# Altium project EthernetSwitchBoard.PrjPcb
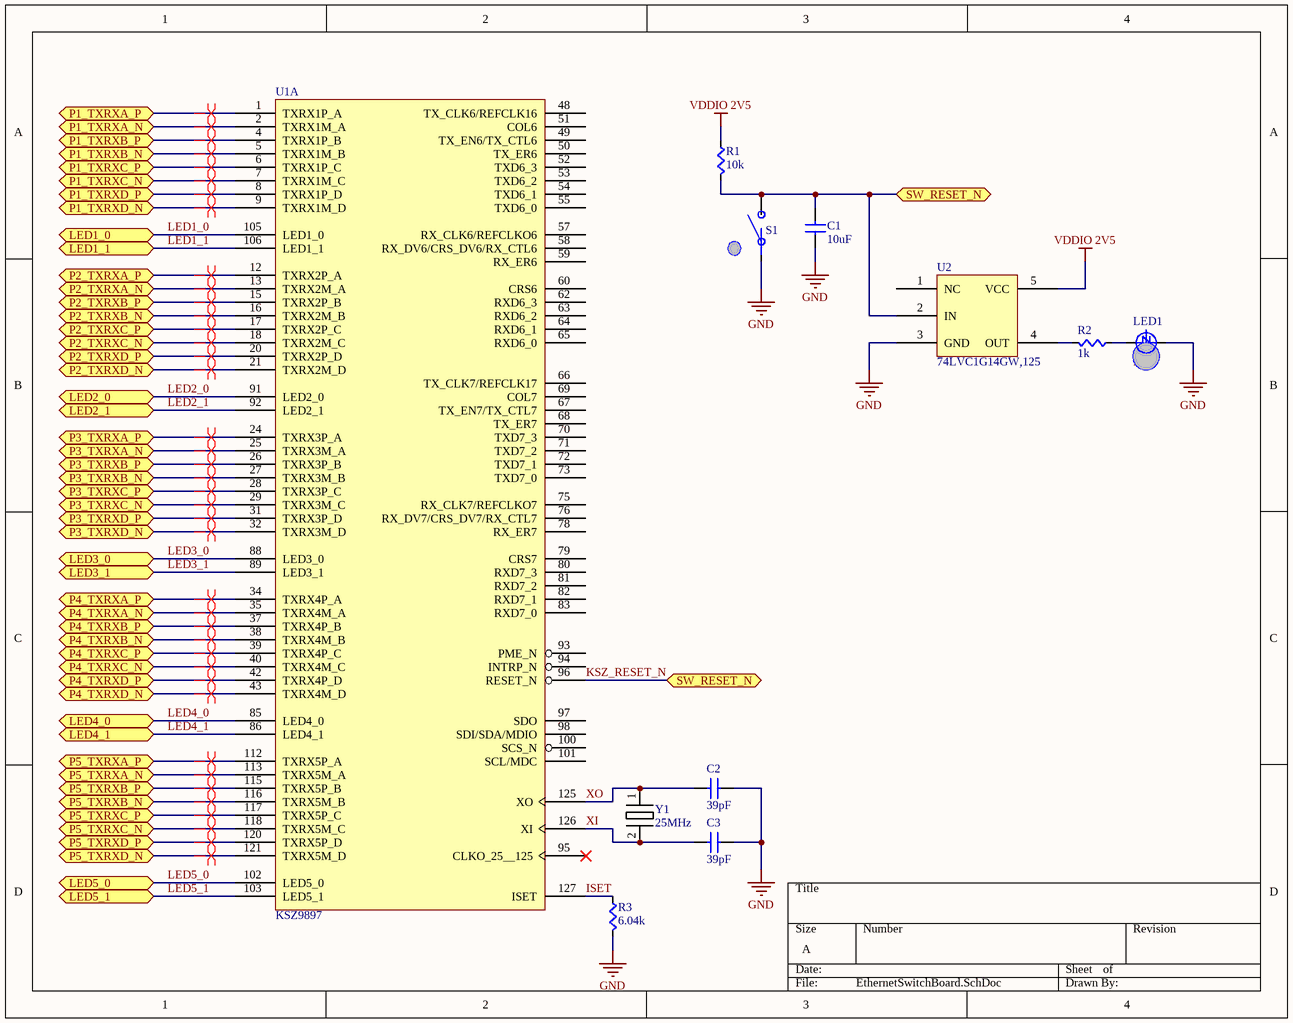
[diagram p0: EthernetSwitchBoard.SchDoc]
3 sheets, 145 parts. Net scope: flat (ports and power ports of the same name join across sheets).
Board file: EthernetSwitchBoard.PcbDoc
Sheets:
  EthernetSwitchBoard.SchDoc
  SwitchPower.SchDoc
  SwitchConnectors.SchDoc

## Sheet EthernetSwitchBoard.SchDoc
size A

### Parts
C1  value 10uF  [CAPC0603]  (hidden comment: Cap)
C2  value 39pF  [CAPC0603]  (hidden comment: Cap)
C3  value 39pF  [CAPC0603]  (hidden comment: Cap)
LED1  Color: Red  [LED0603]  (hidden comment: LED)
R1  value 10k  [RES0603]  (hidden comment: Res)
R2  value 1k  [RES0603]  (hidden comment: Res)
R3  value 6.04k  [RES0603]  (hidden comment: Res)
S1  Button  [PTS645xxxxSMTR92]  (value not drawn)
U1  KSZ9897  [128-TQFP]  (part A of 2)
U2  74LVC1G14GW,125  [SOT35-5pin]
Y1  25MHz  [HC49/US]

### Ports
LED1_0 (bidir), LED1_1 (bidir), LED2_0 (bidir), LED2_1 (bidir), LED3_0 (bidir), LED3_1 (bidir), LED4_0 (bidir), LED4_1 (bidir), LED5_0 (bidir), LED5_1 (bidir), P1_TXRXA_N (bidir), P1_TXRXA_P (bidir), P1_TXRXB_N (bidir), P1_TXRXB_P (bidir), P1_TXRXC_N (bidir), P1_TXRXC_P (bidir), P1_TXRXD_N (bidir), P1_TXRXD_P (bidir), P2_TXRXA_N (bidir), P2_TXRXA_P (bidir), P2_TXRXB_N (bidir), P2_TXRXB_P (bidir), P2_TXRXC_N (bidir), P2_TXRXC_P (bidir), P2_TXRXD_N (bidir), P2_TXRXD_P (bidir), P3_TXRXA_N (bidir), P3_TXRXA_P (bidir), P3_TXRXB_N (bidir), P3_TXRXB_P (bidir), P3_TXRXC_N (bidir), P3_TXRXC_P (bidir), P3_TXRXD_N (bidir), P3_TXRXD_P (bidir), P4_TXRXA_N (bidir), P4_TXRXA_P (bidir), P4_TXRXB_N (bidir), P4_TXRXB_P (bidir), P4_TXRXC_N (bidir), P4_TXRXC_P (bidir), P4_TXRXD_N (bidir), P4_TXRXD_P (bidir), P5_TXRXA_N (bidir), P5_TXRXA_P (bidir), P5_TXRXB_N (bidir), P5_TXRXB_P (bidir), P5_TXRXC_N (bidir), P5_TXRXC_P (bidir), P5_TXRXD_N (bidir), P5_TXRXD_P (bidir), SW_RESET_N (bidir)

### Nets
GND: C1.2(B) C2.2(B) C3.2(B) LED1.C R3.1(A) S1.A U2.3(GND)
VDDIO 2V5: R1.2(B) U2.5(VCC)
ISET: R3.2(B) U1.127(ISET)
KSZ_RESET_N: C1.1(A) R1.1(A) S1.B U1.96(RESET_N) U2.2(IN) ; port SW_RESET_N
LED1_0: U1.105(LED1_0) ; port LED1_0
LED1_1: U1.106(LED1_1) ; port LED1_1
LED2_0: U1.91(LED2_0) ; port LED2_0
LED2_1: U1.92(LED2_1) ; port LED2_1
LED3_0: U1.88(LED3_0) ; port LED3_0
LED3_1: U1.89(LED3_1) ; port LED3_1
LED4_0: U1.85(LED4_0) ; port LED4_0
LED4_1: U1.86(LED4_1) ; port LED4_1
LED5_0: U1.102(LED5_0) ; port LED5_0
LED5_1: U1.103(LED5_1) ; port LED5_1
P1_TXRXA_N: U1.2(TXRX1M_A) ; port P1_TXRXA_N
P1_TXRXA_P: U1.1(TXRX1P_A) ; port P1_TXRXA_P
P1_TXRXB_N: U1.5(TXRX1M_B) ; port P1_TXRXB_N
P1_TXRXB_P: U1.4(TXRX1P_B) ; port P1_TXRXB_P
P1_TXRXC_N: U1.7(TXRX1M_C) ; port P1_TXRXC_N
P1_TXRXC_P: U1.6(TXRX1P_C) ; port P1_TXRXC_P
P1_TXRXD_N: U1.9(TXRX1M_D) ; port P1_TXRXD_N
P1_TXRXD_P: U1.8(TXRX1P_D) ; port P1_TXRXD_P
P2_TXRXA_N: U1.13(TXRX2M_A) ; port P2_TXRXA_N
P2_TXRXA_P: U1.12(TXRX2P_A) ; port P2_TXRXA_P
P2_TXRXB_N: U1.16(TXRX2M_B) ; port P2_TXRXB_N
P2_TXRXB_P: U1.15(TXRX2P_B) ; port P2_TXRXB_P
P2_TXRXC_N: U1.18(TXRX2M_C) ; port P2_TXRXC_N
P2_TXRXC_P: U1.17(TXRX2P_C) ; port P2_TXRXC_P
P2_TXRXD_N: U1.21(TXRX2M_D) ; port P2_TXRXD_N
P2_TXRXD_P: U1.20(TXRX2P_D) ; port P2_TXRXD_P
P3_TXRXA_N: U1.25(TXRX3M_A) ; port P3_TXRXA_N
P3_TXRXA_P: U1.24(TXRX3P_A) ; port P3_TXRXA_P
P3_TXRXB_N: U1.27(TXRX3M_B) ; port P3_TXRXB_N
P3_TXRXB_P: U1.26(TXRX3P_B) ; port P3_TXRXB_P
P3_TXRXC_N: U1.29(TXRX3M_C) ; port P3_TXRXC_N
P3_TXRXC_P: U1.28(TXRX3P_C) ; port P3_TXRXC_P
P3_TXRXD_N: U1.32(TXRX3M_D) ; port P3_TXRXD_N
P3_TXRXD_P: U1.31(TXRX3P_D) ; port P3_TXRXD_P
P4_TXRXA_N: U1.35(TXRX4M_A) ; port P4_TXRXA_N
P4_TXRXA_P: U1.34(TXRX4P_A) ; port P4_TXRXA_P
P4_TXRXB_N: U1.38(TXRX4M_B) ; port P4_TXRXB_N
P4_TXRXB_P: U1.37(TXRX4P_B) ; port P4_TXRXB_P
P4_TXRXC_N: U1.40(TXRX4M_C) ; port P4_TXRXC_N
P4_TXRXC_P: U1.39(TXRX4P_C) ; port P4_TXRXC_P
P4_TXRXD_N: U1.43(TXRX4M_D) ; port P4_TXRXD_N
P4_TXRXD_P: U1.42(TXRX4P_D) ; port P4_TXRXD_P
P5_TXRXA_N: U1.113(TXRX5M_A) ; port P5_TXRXA_N
P5_TXRXA_P: U1.112(TXRX5P_A) ; port P5_TXRXA_P
P5_TXRXB_N: U1.116(TXRX5M_B) ; port P5_TXRXB_N
P5_TXRXB_P: U1.115(TXRX5P_B) ; port P5_TXRXB_P
P5_TXRXC_N: U1.118(TXRX5M_C) ; port P5_TXRXC_N
P5_TXRXC_P: U1.117(TXRX5P_C) ; port P5_TXRXC_P
P5_TXRXD_N: U1.121(TXRX5M_D) ; port P5_TXRXD_N
P5_TXRXD_P: U1.120(TXRX5P_D) ; port P5_TXRXD_P
XI: C3.1(A) U1.126(XI) Y1.2
XO: C2.1(A) U1.125(XO) Y1.1
NetLED1_A: LED1.A R2.2(B)
NetR2_1: R2.1(A) U2.4(OUT)

Not connected (* = marked no-connect by the designer): U1 48(TX_CLK6/REFCLK16) 49(TX_EN6/TX_CTL6) 50(TX_ER6) 51(COL6) 52(TXD6_3) 53(TXD6_2) 54(TXD6_1) 55(TXD6_0) 57(RX_CLK6/REFCLKO6) 58(RX_DV6/CRS_DV6/RX_CTL6) 59(RX_ER6) 60(CRS6) 62(RXD6_3) 63(RXD6_2) 64(RXD6_1) 65(RXD6_0) 66(TX_CLK7/REFCLK17) 67(TX_EN7/TX_CTL7) 68(TX_ER7) 69(COL7) 70(TXD7_3) 71(TXD7_2) 72(TXD7_1) 73(TXD7_0) 75(RX_CLK7/REFCLKO7) 76(RX_DV7/CRS_DV7/RX_CTL7) 78(RX_ER7) 79(CRS7) 80(RXD7_3) 81(RXD7_2) 82(RXD7_1) 83(RXD7_0) 93(PME_N) 94(INTRP_N) 95(CLKO_25__125)* 97(SDO) 98(SDI/SDA/MDIO) 100(SCS_N) 101(SCL/MDC); U2 1(NC)

### Layout directives
differential pair: P1_TXRXA_N, P1_TXRXA_P, P1_TXRXB_N, P1_TXRXB_P, P1_TXRXC_N, P1_TXRXC_P, P1_TXRXD_N, P1_TXRXD_P, P2_TXRXA_N, P2_TXRXA_P, P2_TXRXB_N, P2_TXRXB_P, P2_TXRXC_N, P2_TXRXC_P, P2_TXRXD_N, P2_TXRXD_P, P3_TXRXA_N, P3_TXRXA_P, P3_TXRXB_N, P3_TXRXB_P, P3_TXRXC_N, P3_TXRXC_P, P3_TXRXD_N, P3_TXRXD_P, P4_TXRXA_N, P4_TXRXA_P, P4_TXRXB_N, P4_TXRXB_P, P4_TXRXC_N, P4_TXRXC_P, P4_TXRXD_N, P4_TXRXD_P, P5_TXRXA_N, P5_TXRXA_P, P5_TXRXB_N, P5_TXRXB_P, P5_TXRXC_N, P5_TXRXC_P, P5_TXRXD_N, P5_TXRXD_P

### Library data of the parts
C2 C3 = Cap: CAP CER 39PF 100V C0G/NP0 0603; Supplier 1: Digi-Key; Supplier Part Number 1: 478-5773-1-ND
S1 = Button: SPST Button; Supplier 1: Digi-Key; Supplier Part Number 1: CKN9087CT-ND
U1 = KSZ9897RTXC-TR: Ethernet Switch 10/100/1000 Base-T PHY I²C, SPI Interface 128-TQFP (14x14); Supplier 1: Digi-Key; Supplier Part Number 1: KSZ9897RTXC-CT-ND
U2 = 74LVC1G14GW,125: IC SCHMITT-TRIG INV 5TSSOP; Supplier Part Number 1: 1727-3072-1-ND; Supplier 1: Digi-Key
Y1 = ABLS-25.000MHZ-B4-F-T: 25MHz ±30ppm Crystal 18pF 40 Ohm -20°C ~ 70°C Surface Mount HC49/US; Supplier Part Number 1: 535-10235-1-ND; Supplier 1: Digi-Key
C1 = Cap: Supplier 1: Digi-Key; Supplier Part Number 1: 1276-1119-1-ND
LED1 = LED: Supplier 1: Digi-Key; Supplier Part Number 1: 754-1122-1-ND
R1-R3 = Res: Supplier 1: Digi-Key
  R1: Supplier Part Number 1: RMCF0603JT10K0CT-ND
  R2: Supplier Part Number 1: RMCF0603JT1K00CT-ND
  R3: Supplier Part Number 1: RMCF0603FT6K04CT-ND

## Sheet SwitchPower.SchDoc
size A
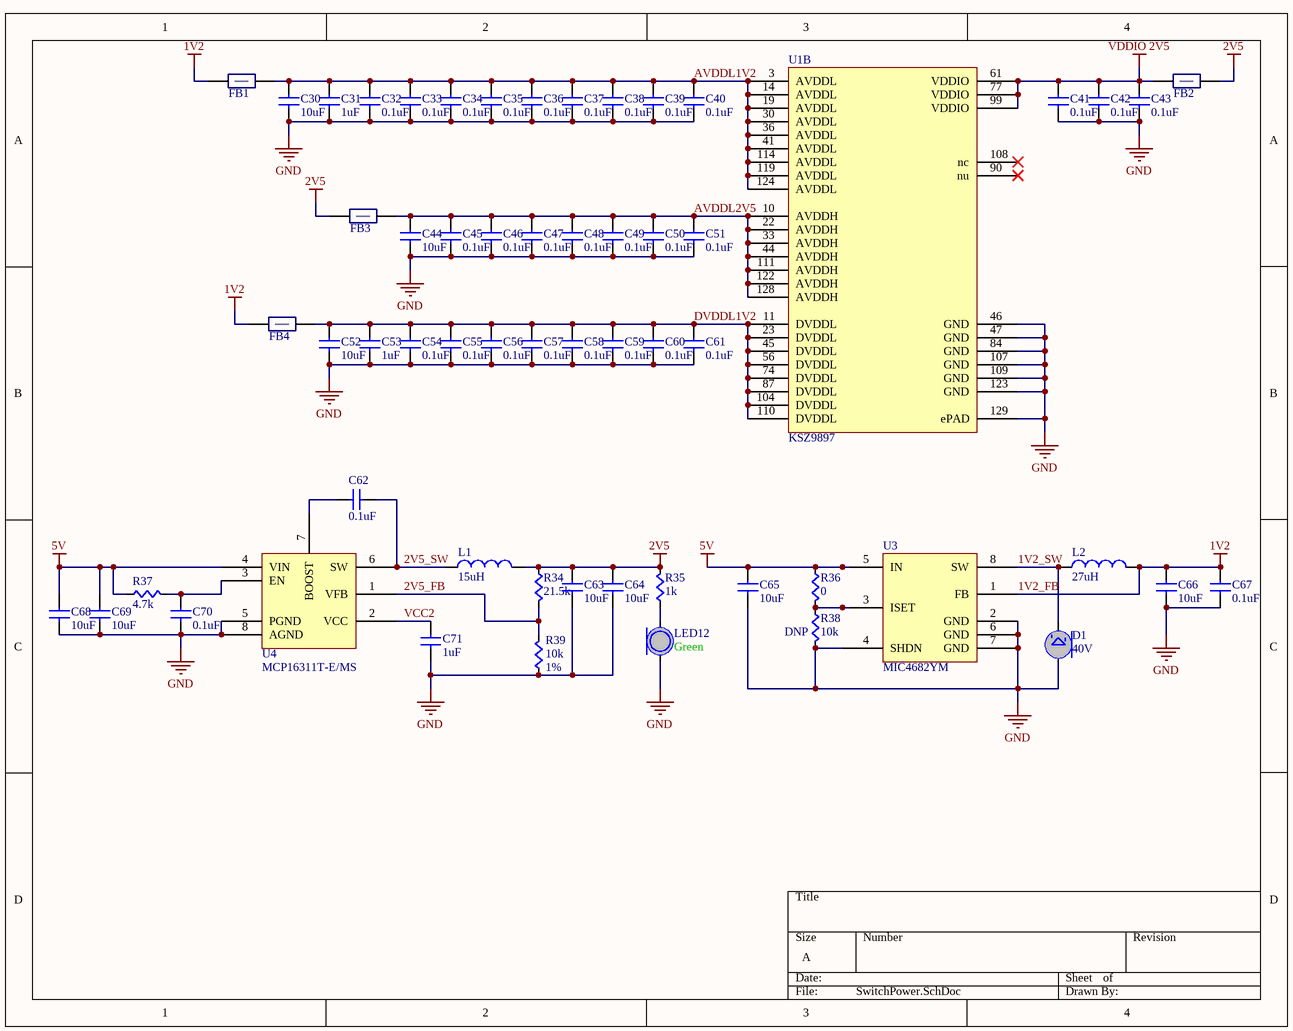
[diagram p1: SwitchPower.SchDoc]

### Parts
C30  value 10uF  [CAPC0603]  (hidden comment: Cap)
C31  value 1uF  [CAPC0603]  (hidden comment: Cap)
C32  value 0.1uF  [CAPC0603]  (hidden comment: Cap)
C33  value 0.1uF  [CAPC0603]  (hidden comment: Cap)
C34  value 0.1uF  [CAPC0603]  (hidden comment: Cap)
C35  value 0.1uF  [CAPC0603]  (hidden comment: Cap)
C36  value 0.1uF  [CAPC0603]  (hidden comment: Cap)
C37  value 0.1uF  [CAPC0603]  (hidden comment: Cap)
C38  value 0.1uF  [CAPC0603]  (hidden comment: Cap)
C39  value 0.1uF  [CAPC0603]  (hidden comment: Cap)
C40  value 0.1uF  [CAPC0603]  (hidden comment: Cap)
C41  value 0.1uF  [CAPC0603]  (hidden comment: Cap)
C42  value 0.1uF  [CAPC0603]  (hidden comment: Cap)
C43  value 0.1uF  [CAPC0603]  (hidden comment: Cap)
C44  value 10uF  [CAPC0603]  (hidden comment: Cap)
C45  value 0.1uF  [CAPC0603]  (hidden comment: Cap)
C46  value 0.1uF  [CAPC0603]  (hidden comment: Cap)
C47  value 0.1uF  [CAPC0603]  (hidden comment: Cap)
C48  value 0.1uF  [CAPC0603]  (hidden comment: Cap)
C49  value 0.1uF  [CAPC0603]  (hidden comment: Cap)
C50  value 0.1uF  [CAPC0603]  (hidden comment: Cap)
C51  value 0.1uF  [CAPC0603]  (hidden comment: Cap)
C52  value 10uF  [CAPC0603]  (hidden comment: Cap)
C53  value 1uF  [CAPC0603]  (hidden comment: Cap)
C54  value 0.1uF  [CAPC0603]  (hidden comment: Cap)
C55  value 0.1uF  [CAPC0603]  (hidden comment: Cap)
C56  value 0.1uF  [CAPC0603]  (hidden comment: Cap)
C57  value 0.1uF  [CAPC0603]  (hidden comment: Cap)
C58  value 0.1uF  [CAPC0603]  (hidden comment: Cap)
C59  value 0.1uF  [CAPC0603]  (hidden comment: Cap)
C60  value 0.1uF  [CAPC0603]  (hidden comment: Cap)
C61  value 0.1uF  [CAPC0603]  (hidden comment: Cap)
C62  value 0.1uF  [CAPC0603]  (hidden comment: Cap)
C63  value 10uF  [CAPC0603]  (hidden comment: Cap)
C64  value 10uF  [CAPC0603]  (hidden comment: Cap)
C65  value 10uF  [CAPC0603]  (hidden comment: Cap)
C66  value 10uF  [CAPC0603]  (hidden comment: Cap)
C67  value 0.1uF  [CAPC0603]  (hidden comment: Cap)
C68  value 10uF  [CAPC0603]  (hidden comment: Cap)
C69  value 10uF  [CAPC0603]  (hidden comment: Cap)
C70  value 0.1uF  [CAPC0603]  (hidden comment: Cap)
C71  value 1uF  [CAPC0603]  (hidden comment: Cap)
D1  Zener Voltage: 40V  [SMASeries]  (hidden comment: Zener)
FB1  FBead  [RES0603]  (value not drawn)
FB2  FBead  [RES0603]  (value not drawn)
FB3  FBead  [RES0603]  (value not drawn)
FB4  FBead  [RES0603]  (value not drawn)
L1  Inductance: 15uH  [RES0603]  (hidden comment: Inductor)
L2  Inductance: 27uH  [RES0603]  (hidden comment: Inductor)
LED12  Color: Green  [LED0603]  (hidden comment: LED)
R34  value 21.5k  [RES0603]  (hidden comment: Res)
R35  value 1k  [RES0603]  (hidden comment: Res)
R36  value 0  [RES0603]  (hidden comment: Res)
R37  value 4.7k  [RES0603]  (hidden comment: Res)
R38  value 10k  [RES0603]  (hidden comment: Res)
R39  value 10k  Tolerance: 1%  [RES0603]  (hidden comment: Res)
U1  KSZ9897  [128-TQFP]  (part B of 2)
U3  MIC4682YM  [8-SOIC]
U4  MCP16311T-E/MS  [TSSOP-8]

### Nets
1V2_FB: C66.1(A) C67.1(A) FB1.1(A) FB4.1(A) L2.2(B) U3.1(FB)  [also labelled 1V2]
2V5: C63.1(A) C64.1(A) FB2.2(B) FB3.1(A) L1.2(B) R34.2(B) R35.1(A)
5V: C65.1(A) C68.1(A) C69.1(A) R36.2(B) R37.2(B) U3.5(IN) U4.4(VIN)
GND: C30.2(B) C31.2(B) C32.2(B) C33.2(B) C34.2(B) C35.2(B) C36.2(B) C37.2(B) C38.2(B) C39.2(B) C40.2(B) C41.2(B) C42.2(B) C43.2(B) C44.2(B) C45.2(B) C46.2(B) C47.2(B) C48.2(B) C49.2(B) C50.2(B) C51.2(B) C52.2(B) C53.2(B) C54.2(B) C55.2(B) C56.2(B) C57.2(B) C58.2(B) C59.2(B) C60.2(B) C61.2(B) C63.2(B) C64.2(B) C65.2(B) C66.2(B) C67.2(B) C68.2(B) C69.2(B) C70.2(B) C71.2(B) D1.A LED12.C R38.1(A) R39.2(B) U1.46(GND) U1.47(GND) U1.84(GND) U1.107(GND) U1.109(GND) U1.123(GND) U1.129(ePAD) U3.2(GND) U3.4(SHDN) U3.6(GND) U3.7(GND) U4.5(PGND) U4.8(AGND)
VDDIO 2V5: C41.1(A) C42.1(A) C43.1(A) FB2.1(A) U1.61(VDDIO) U1.77(VDDIO) U1.99(VDDIO)
1V2_SW: D1.C L2.1(A) U3.8(SW)
2V5_FB: R34.1(A) R39.1(A) U4.1(VFB)
2V5_SW: C62.2(B) L1.1(A) U4.6(SW)
AVDDL1V2: C30.1(A) C31.1(A) C32.1(A) C33.1(A) C34.1(A) C35.1(A) C36.1(A) C37.1(A) C38.1(A) C39.1(A) C40.1(A) FB1.2(B) U1.3(AVDDL) U1.14(AVDDL) U1.19(AVDDL) U1.30(AVDDL) U1.36(AVDDL) U1.41(AVDDL) U1.114(AVDDL) U1.119(AVDDL) U1.124(AVDDL)
AVDDL2V5: C44.1(A) C45.1(A) C46.1(A) C47.1(A) C48.1(A) C49.1(A) C50.1(A) C51.1(A) FB3.2(B) U1.10(AVDDH) U1.22(AVDDH) U1.33(AVDDH) U1.44(AVDDH) U1.111(AVDDH) U1.122(AVDDH) U1.128(AVDDH)
DVDDL1V2: C52.1(A) C53.1(A) C54.1(A) C55.1(A) C56.1(A) C57.1(A) C58.1(A) C59.1(A) C60.1(A) C61.1(A) FB4.2(B) U1.11(DVDDL) U1.23(DVDDL) U1.45(DVDDL) U1.56(DVDDL) U1.74(DVDDL) U1.87(DVDDL) U1.104(DVDDL) U1.110(DVDDL)
VCC2: C71.1(A) U4.2(VCC)
NetC62_1: C62.1(A) U4.7(BOOST)
NetC70_1: C70.1(A) R37.1(A) U4.3(EN)
NetLED12_A: LED12.A R35.2(B)
NetR36_1: R36.1(A) R38.2(B) U3.3(ISET)

Not connected (* = marked no-connect by the designer): U1 90(nu)* 108(nc)*

### Library data of the parts
D1 = Zener: Zener Diode; Supplier 1: Digi-Key; Supplier Part Number 1: CD0603-Z3V3CT-ND
FB1-FB4 = FBead: Ferrite Bead; Supplier 1: Digi-Key; Supplier Part Number 1: 445-2988-1-ND
U1 = KSZ9897RTXC-TR: as U1 on sheet EthernetSwitchBoard; Supplier 1: Digi-Key; Supplier Part Number 1: KSZ9897RTXC-CT-ND
U3 = MIC4682YM: IC REG BUCK ADJ 2A 8SOIC; Supplier Part Number 1: 576-1802-5-ND; Supplier 1: Digi-Key
U4 = MCP16311T-E/MS: IC REG BUCK ADJ 1A SYNC 8MSOP; Supplier Part Number 1: MCP16311T-E/MSCT-ND; Supplier 1: Digi-Key
C30-C71 = Cap: Supplier 1: Digi-Key
  C30 C44 C52 C63-C66 C68 C69: Supplier Part Number 1: 1276-1119-1-ND
  C31 C53 C71: Supplier Part Number 1: 1276-1946-1-ND
  C32-C43 C45-C51 C54-C62 C67 C70: Supplier Part Number 1: 1276-1000-1-ND
L1 L2 = Inductor: Supplier 1: Digi-Key
  L1: Supplier Part Number 1: 445-6151-1-ND
  L2: Supplier Part Number 1: 535-11596-1-ND
LED12 = LED: Supplier 1: Digi-Key; Supplier Part Number 1: 754-1121-1-ND
R34-R39 = Res: Supplier 1: Digi-Key
  R34: Supplier Part Number 1: RMCF0603FT21K5CT-ND
  R35: Supplier Part Number 1: RMCF0603JT1K00CT-ND
  R36: Supplier Part Number 1: RMCF0603ZT0R00CT-ND
  R37: Supplier Part Number 1: RMCF0603JT4K70CT-ND
  R38: Supplier Part Number 1: RMCF0603JT10K0CT-ND; DNP: DNP
  R39: Supplier Part Number 1: RMCF0603FT10K0CT-ND

## Sheet SwitchConnectors.SchDoc
size A
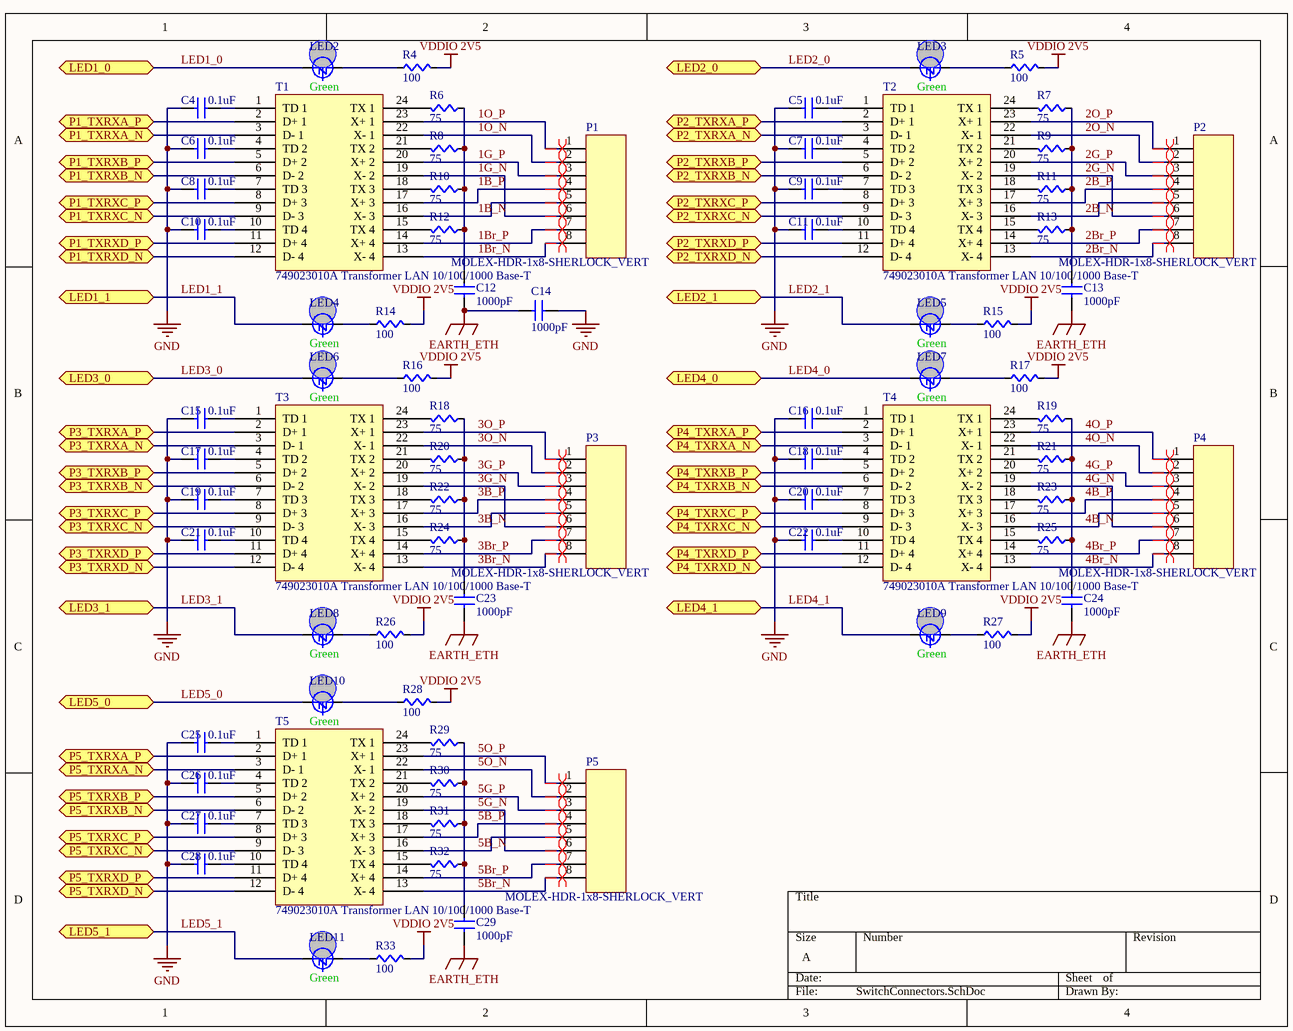
[diagram p2: SwitchConnectors.SchDoc]

### Parts
C4  value 0.1uF  [CAPC0603]  (hidden comment: Cap)
C5  value 0.1uF  [CAPC0603]  (hidden comment: Cap)
C6  value 0.1uF  [CAPC0603]  (hidden comment: Cap)
C7  value 0.1uF  [CAPC0603]  (hidden comment: Cap)
C8  value 0.1uF  [CAPC0603]  (hidden comment: Cap)
C9  value 0.1uF  [CAPC0603]  (hidden comment: Cap)
C10  value 0.1uF  [CAPC0603]  (hidden comment: Cap)
C11  value 0.1uF  [CAPC0603]  (hidden comment: Cap)
C12  value 1000pF  [CAPC0603]  (hidden comment: Cap)
C13  value 1000pF  [CAPC0603]  (hidden comment: Cap)
C14  value 1000pF  [CAPC0603]  (hidden comment: Cap)
C15  value 0.1uF  [CAPC0603]  (hidden comment: Cap)
C16  value 0.1uF  [CAPC0603]  (hidden comment: Cap)
C17  value 0.1uF  [CAPC0603]  (hidden comment: Cap)
C18  value 0.1uF  [CAPC0603]  (hidden comment: Cap)
C19  value 0.1uF  [CAPC0603]  (hidden comment: Cap)
C20  value 0.1uF  [CAPC0603]  (hidden comment: Cap)
C21  value 0.1uF  [CAPC0603]  (hidden comment: Cap)
C22  value 0.1uF  [CAPC0603]  (hidden comment: Cap)
C23  value 1000pF  [CAPC0603]  (hidden comment: Cap)
C24  value 1000pF  [CAPC0603]  (hidden comment: Cap)
C25  value 0.1uF  [CAPC0603]  (hidden comment: Cap)
C26  value 0.1uF  [CAPC0603]  (hidden comment: Cap)
C27  value 0.1uF  [CAPC0603]  (hidden comment: Cap)
C28  value 0.1uF  [CAPC0603]  (hidden comment: Cap)
C29  value 1000pF  [CAPC0603]  (hidden comment: Cap)
LED2  Color: Green  [LED0603]  (hidden comment: LED)
LED3  Color: Green  [LED0603]  (hidden comment: LED)
LED4  Color: Green  [LED0603]  (hidden comment: LED)
LED5  Color: Green  [LED0603]  (hidden comment: LED)
LED6  Color: Green  [LED0603]  (hidden comment: LED)
LED7  Color: Green  [LED0603]  (hidden comment: LED)
LED8  Color: Green  [LED0603]  (hidden comment: LED)
LED9  Color: Green  [LED0603]  (hidden comment: LED)
LED10  Color: Green  [LED0603]  (hidden comment: LED)
LED11  Color: Green  [LED0603]  (hidden comment: LED)
P1  MOLEX-HDR-1x8-SHERLOCK_VERT  [MOLEX-HDR-1X8-SHERLOCK-VERT]
P2  MOLEX-HDR-1x8-SHERLOCK_VERT  [MOLEX-HDR-1X8-SHERLOCK-VERT]
P3  MOLEX-HDR-1x8-SHERLOCK_VERT  [MOLEX-HDR-1X8-SHERLOCK-VERT]
P4  MOLEX-HDR-1x8-SHERLOCK_VERT  [MOLEX-HDR-1X8-SHERLOCK-VERT]
P5  MOLEX-HDR-1x8-SHERLOCK_VERT  [MOLEX-HDR-1X8-SHERLOCK-VERT]
R4  value 100  [RES0603]  (hidden comment: Res)
R5  value 100  [RES0603]  (hidden comment: Res)
R6  value 75  [RES0603]  (hidden comment: Res)
R7  value 75  [RES0603]  (hidden comment: Res)
R8  value 75  [RES0603]  (hidden comment: Res)
R9  value 75  [RES0603]  (hidden comment: Res)
R10  value 75  [RES0603]  (hidden comment: Res)
R11  value 75  [RES0603]  (hidden comment: Res)
R12  value 75  [RES0603]  (hidden comment: Res)
R13  value 75  [RES0603]  (hidden comment: Res)
R14  value 100  [RES0603]  (hidden comment: Res)
R15  value 100  [RES0603]  (hidden comment: Res)
R16  value 100  [RES0603]  (hidden comment: Res)
R17  value 100  [RES0603]  (hidden comment: Res)
R18  value 75  [RES0603]  (hidden comment: Res)
R19  value 75  [RES0603]  (hidden comment: Res)
R20  value 75  [RES0603]  (hidden comment: Res)
R21  value 75  [RES0603]  (hidden comment: Res)
R22  value 75  [RES0603]  (hidden comment: Res)
R23  value 75  [RES0603]  (hidden comment: Res)
R24  value 75  [RES0603]  (hidden comment: Res)
R25  value 75  [RES0603]  (hidden comment: Res)
R26  value 100  [RES0603]  (hidden comment: Res)
R27  value 100  [RES0603]  (hidden comment: Res)
R28  value 100  [RES0603]  (hidden comment: Res)
R29  value 75  [RES0603]  (hidden comment: Res)
R30  value 75  [RES0603]  (hidden comment: Res)
R31  value 75  [RES0603]  (hidden comment: Res)
R32  value 75  [RES0603]  (hidden comment: Res)
R33  value 100  [RES0603]  (hidden comment: Res)
T1  749023010A Transformer LAN 10/100/1000 Base-T  [749023010A]
T2  749023010A Transformer LAN 10/100/1000 Base-T  [749023010A]
T3  749023010A Transformer LAN 10/100/1000 Base-T  [749023010A]
T4  749023010A Transformer LAN 10/100/1000 Base-T  [749023010A]
T5  749023010A Transformer LAN 10/100/1000 Base-T  [749023010A]

### Ports
LED1_0 (bidir), LED1_1 (bidir), LED2_0 (bidir), LED2_1 (bidir), LED3_0 (bidir), LED3_1 (bidir), LED4_0 (bidir), LED4_1 (bidir), LED5_0 (bidir), LED5_1 (bidir), P1_TXRXA_N (bidir), P1_TXRXA_P (bidir), P1_TXRXB_N (bidir), P1_TXRXB_P (bidir), P1_TXRXC_N (bidir), P1_TXRXC_P (bidir), P1_TXRXD_N (bidir), P1_TXRXD_P (bidir), P2_TXRXA_N (bidir), P2_TXRXA_P (bidir), P2_TXRXB_N (bidir), P2_TXRXB_P (bidir), P2_TXRXC_N (bidir), P2_TXRXC_P (bidir), P2_TXRXD_N (bidir), P2_TXRXD_P (bidir), P3_TXRXA_N (bidir), P3_TXRXA_P (bidir), P3_TXRXB_N (bidir), P3_TXRXB_P (bidir), P3_TXRXC_N (bidir), P3_TXRXC_P (bidir), P3_TXRXD_N (bidir), P3_TXRXD_P (bidir), P4_TXRXA_N (bidir), P4_TXRXA_P (bidir), P4_TXRXB_N (bidir), P4_TXRXB_P (bidir), P4_TXRXC_N (bidir), P4_TXRXC_P (bidir), P4_TXRXD_N (bidir), P4_TXRXD_P (bidir), P5_TXRXA_N (bidir), P5_TXRXA_P (bidir), P5_TXRXB_N (bidir), P5_TXRXB_P (bidir), P5_TXRXC_N (bidir), P5_TXRXC_P (bidir), P5_TXRXD_N (bidir), P5_TXRXD_P (bidir)

### Nets
EARTH_ETH: C12.1(A) C13.1(A) C14.2(B) C23.1(A) C24.1(A) C29.1(A)
GND: C4.1(A) C5.1(A) C6.1(A) C7.1(A) C8.1(A) C9.1(A) C10.1(A) C11.1(A) C14.1(A) C15.1(A) C16.1(A) C17.1(A) C18.1(A) C19.1(A) C20.1(A) C21.1(A) C22.1(A) C25.1(A) C26.1(A) C27.1(A) C28.1(A)
VDDIO 2V5: R4.1(A) R5.1(A) R14.1(A) R15.1(A) R16.1(A) R17.1(A) R26.1(A) R27.1(A) R28.1(A) R33.1(A)
1B_N: P1.5 T1.16(X-_3)
1B_P: P1.4 T1.17(X+_3)
1Br_N: P1.8 T1.13(X-_4)
1Br_P: P1.7 T1.14(X+_4)
1G_N: P1.6 T1.19(X-_2)
1G_P: P1.3 T1.20(X+_2)
1O_N: P1.2 T1.22(X-_1)
1O_P: P1.1 T1.23(X+_1)
2B_N: P2.5 T2.16(X-_3)
2B_P: P2.4 T2.17(X+_3)
2Br_N: P2.8 T2.13(X-_4)
2Br_P: P2.7 T2.14(X+_4)
2G_N: P2.6 T2.19(X-_2)
2G_P: P2.3 T2.20(X+_2)
2O_N: P2.2 T2.22(X-_1)
2O_P: P2.1 T2.23(X+_1)
3B_N: P3.5 T3.16(X-_3)
3B_P: P3.4 T3.17(X+_3)
3Br_N: P3.8 T3.13(X-_4)
3Br_P: P3.7 T3.14(X+_4)
3G_N: P3.6 T3.19(X-_2)
3G_P: P3.3 T3.20(X+_2)
3O_N: P3.2 T3.22(X-_1)
3O_P: P3.1 T3.23(X+_1)
4B_N: P4.5 T4.16(X-_3)
4B_P: P4.4 T4.17(X+_3)
4Br_N: P4.8 T4.13(X-_4)
4Br_P: P4.7 T4.14(X+_4)
4G_N: P4.6 T4.19(X-_2)
4G_P: P4.3 T4.20(X+_2)
4O_N: P4.2 T4.22(X-_1)
4O_P: P4.1 T4.23(X+_1)
5B_N: P5.5 T5.16(X-_3)
5B_P: P5.4 T5.17(X+_3)
5Br_N: P5.8 T5.13(X-_4)
5Br_P: P5.7 T5.14(X+_4)
5G_N: P5.6 T5.19(X-_2)
5G_P: P5.3 T5.20(X+_2)
5O_N: P5.2 T5.22(X-_1)
5O_P: P5.1 T5.23(X+_1)
LED1_0: LED2.C ; port LED1_0
LED1_1: LED4.C ; port LED1_1
LED2_0: LED3.C ; port LED2_0
LED2_1: LED5.C ; port LED2_1
LED3_0: LED6.C ; port LED3_0
LED3_1: LED8.C ; port LED3_1
LED4_0: LED7.C ; port LED4_0
LED4_1: LED9.C ; port LED4_1
LED5_0: LED10.C ; port LED5_0
LED5_1: LED11.C ; port LED5_1
P1_TXRXA_N: T1.3(D-_1) ; port P1_TXRXA_N
P1_TXRXA_P: T1.2(D+_1) ; port P1_TXRXA_P
P1_TXRXB_N: T1.6(D-_2) ; port P1_TXRXB_N
P1_TXRXB_P: T1.5(D+_2) ; port P1_TXRXB_P
P1_TXRXC_N: T1.9(D-_3) ; port P1_TXRXC_N
P1_TXRXC_P: T1.8(D+_3) ; port P1_TXRXC_P
P1_TXRXD_N: T1.12(D-_4) ; port P1_TXRXD_N
P1_TXRXD_P: T1.11(D+_4) ; port P1_TXRXD_P
P2_TXRXA_N: T2.3(D-_1) ; port P2_TXRXA_N
P2_TXRXA_P: T2.2(D+_1) ; port P2_TXRXA_P
P2_TXRXB_N: T2.6(D-_2) ; port P2_TXRXB_N
P2_TXRXB_P: T2.5(D+_2) ; port P2_TXRXB_P
P2_TXRXC_N: T2.9(D-_3) ; port P2_TXRXC_N
P2_TXRXC_P: T2.8(D+_3) ; port P2_TXRXC_P
P2_TXRXD_N: T2.12(D-_4) ; port P2_TXRXD_N
P2_TXRXD_P: T2.11(D+_4) ; port P2_TXRXD_P
P3_TXRXA_N: T3.3(D-_1) ; port P3_TXRXA_N
P3_TXRXA_P: T3.2(D+_1) ; port P3_TXRXA_P
P3_TXRXB_N: T3.6(D-_2) ; port P3_TXRXB_N
P3_TXRXB_P: T3.5(D+_2) ; port P3_TXRXB_P
P3_TXRXC_N: T3.9(D-_3) ; port P3_TXRXC_N
P3_TXRXC_P: T3.8(D+_3) ; port P3_TXRXC_P
P3_TXRXD_N: T3.12(D-_4) ; port P3_TXRXD_N
P3_TXRXD_P: T3.11(D+_4) ; port P3_TXRXD_P
P4_TXRXA_N: T4.3(D-_1) ; port P4_TXRXA_N
P4_TXRXA_P: T4.2(D+_1) ; port P4_TXRXA_P
P4_TXRXB_N: T4.6(D-_2) ; port P4_TXRXB_N
P4_TXRXB_P: T4.5(D+_2) ; port P4_TXRXB_P
P4_TXRXC_N: T4.9(D-_3) ; port P4_TXRXC_N
P4_TXRXC_P: T4.8(D+_3) ; port P4_TXRXC_P
P4_TXRXD_N: T4.12(D-_4) ; port P4_TXRXD_N
P4_TXRXD_P: T4.11(D+_4) ; port P4_TXRXD_P
P5_TXRXA_N: T5.3(D-_1) ; port P5_TXRXA_N
P5_TXRXA_P: T5.2(D+_1) ; port P5_TXRXA_P
P5_TXRXB_N: T5.6(D-_2) ; port P5_TXRXB_N
P5_TXRXB_P: T5.5(D+_2) ; port P5_TXRXB_P
P5_TXRXC_N: T5.9(D-_3) ; port P5_TXRXC_N
P5_TXRXC_P: T5.8(D+_3) ; port P5_TXRXC_P
P5_TXRXD_N: T5.12(D-_4) ; port P5_TXRXD_N
P5_TXRXD_P: T5.11(D+_4) ; port P5_TXRXD_P
NetC4_2: C4.2(B) T1.1(TD_1)
NetC5_2: C5.2(B) T2.1(TD_1)
NetC6_2: C6.2(B) T1.4(TD_2)
NetC7_2: C7.2(B) T2.4(TD_2)
NetC8_2: C8.2(B) T1.7(TD_3)
NetC9_2: C9.2(B) T2.7(TD_3)
NetC10_2: C10.2(B) T1.10(TD_4)
NetC11_2: C11.2(B) T2.10(TD_4)
NetC12_2: C12.2(B) R6.2(B) R8.2(B) R10.2(B) R12.2(B)
NetC13_2: C13.2(B) R7.2(B) R9.2(B) R11.2(B) R13.2(B)
NetC15_2: C15.2(B) T3.1(TD_1)
NetC16_2: C16.2(B) T4.1(TD_1)
NetC17_2: C17.2(B) T3.4(TD_2)
NetC18_2: C18.2(B) T4.4(TD_2)
NetC19_2: C19.2(B) T3.7(TD_3)
NetC20_2: C20.2(B) T4.7(TD_3)
NetC21_2: C21.2(B) T3.10(TD_4)
NetC22_2: C22.2(B) T4.10(TD_4)
NetC23_2: C23.2(B) R18.2(B) R20.2(B) R22.2(B) R24.2(B)
NetC24_2: C24.2(B) R19.2(B) R21.2(B) R23.2(B) R25.2(B)
NetC25_2: C25.2(B) T5.1(TD_1)
NetC26_2: C26.2(B) T5.4(TD_2)
NetC27_2: C27.2(B) T5.7(TD_3)
NetC28_2: C28.2(B) T5.10(TD_4)
NetC29_2: C29.2(B) R29.2(B) R30.2(B) R31.2(B) R32.2(B)
NetLED2_A: LED2.A R4.2(B)
NetLED3_A: LED3.A R5.2(B)
NetLED4_A: LED4.A R14.2(B)
NetLED5_A: LED5.A R15.2(B)
NetLED6_A: LED6.A R16.2(B)
NetLED7_A: LED7.A R17.2(B)
NetLED8_A: LED8.A R26.2(B)
NetLED9_A: LED9.A R27.2(B)
NetLED10_A: LED10.A R28.2(B)
NetLED11_A: LED11.A R33.2(B)
NetR6_1: R6.1(A) T1.24(TX_1)
NetR7_1: R7.1(A) T2.24(TX_1)
NetR8_1: R8.1(A) T1.21(TX_2)
NetR9_1: R9.1(A) T2.21(TX_2)
NetR10_1: R10.1(A) T1.18(TX_3)
NetR11_1: R11.1(A) T2.18(TX_3)
NetR12_1: R12.1(A) T1.15(TX_4)
NetR13_1: R13.1(A) T2.15(TX_4)
NetR18_1: R18.1(A) T3.24(TX_1)
NetR19_1: R19.1(A) T4.24(TX_1)
NetR20_1: R20.1(A) T3.21(TX_2)
NetR21_1: R21.1(A) T4.21(TX_2)
NetR22_1: R22.1(A) T3.18(TX_3)
NetR23_1: R23.1(A) T4.18(TX_3)
NetR24_1: R24.1(A) T3.15(TX_4)
NetR25_1: R25.1(A) T4.15(TX_4)
NetR29_1: R29.1(A) T5.24(TX_1)
NetR30_1: R30.1(A) T5.21(TX_2)
NetR31_1: R31.1(A) T5.18(TX_3)
NetR32_1: R32.1(A) T5.15(TX_4)

### Layout directives
differential pair: 1B_N, 1B_P, 1Br_N, 1Br_P, 1G_N, 1G_P, 1O_N, 1O_P, 2B_N, 2B_P, 2Br_N, 2Br_P, 2G_N, 2G_P, 2O_N, 2O_P, 3B_N, 3B_P, 3Br_N, 3Br_P, 3G_N, 3G_P, 3O_N, 3O_P, 4B_N, 4B_P, 4Br_N, 4Br_P, 4G_N, 4G_P, 4O_N, 4O_P, 5B_N, 5B_P, 5Br_N, 5Br_P, 5G_N, 5G_P, 5O_N, 5O_P

### Library data of the parts
P1-P5 = MOLEX-HDR-1x8-SHERLOCK_VERT: CONN HEADER 8POS 2MM VERT TIN; Supplier 1: Digi-Key; Supplier Part Number 1: WM18926-ND
T1-T5 = 749023010A Transformer LAN 10/100/1000 Base-T: TRANSFORMER LAN 10/100/1000 SMD; Supplier 1: Digi-Key; Supplier Part Number 1: 732-5714-1-ND
C4-C29 = Cap: Supplier 1: Digi-Key
  C4-C11 C15-C22 C25-C28: Supplier Part Number 1: 1276-1000-1-ND
  C12-C14 C23 C24 C29: Supplier Part Number 1: 1276-1018-1-ND
LED2-LED11 = LED: Supplier 1: Digi-Key; Supplier Part Number 1: 754-1121-1-ND
R4-R33 = Res: Supplier 1: Digi-Key
  R4 R5 R14-R17 R26-R28 R33: Supplier Part Number 1: RMCF0603JT100RCT-ND
  R6-R13 R18-R25 R29-R32: Supplier Part Number 1: RMCF0603FT75R0CT-ND

## Nets that join several sheets
GND: EthernetSwitchBoard (7 pins), SwitchPower (58 pins), SwitchConnectors (21 pins)
VDDIO 2V5: EthernetSwitchBoard (R1.2 U2.5), SwitchPower (7 pins), SwitchConnectors (10 pins)
LED1_0: EthernetSwitchBoard (U1.105), SwitchConnectors (LED2.C)
LED1_1: EthernetSwitchBoard (U1.106), SwitchConnectors (LED4.C)
LED2_0: EthernetSwitchBoard (U1.91), SwitchConnectors (LED3.C)
LED2_1: EthernetSwitchBoard (U1.92), SwitchConnectors (LED5.C)
LED3_0: EthernetSwitchBoard (U1.88), SwitchConnectors (LED6.C)
LED3_1: EthernetSwitchBoard (U1.89), SwitchConnectors (LED8.C)
LED4_0: EthernetSwitchBoard (U1.85), SwitchConnectors (LED7.C)
LED4_1: EthernetSwitchBoard (U1.86), SwitchConnectors (LED9.C)
LED5_0: EthernetSwitchBoard (U1.102), SwitchConnectors (LED10.C)
LED5_1: EthernetSwitchBoard (U1.103), SwitchConnectors (LED11.C)
P1_TXRXA_N: EthernetSwitchBoard (U1.2), SwitchConnectors (T1.3)
P1_TXRXA_P: EthernetSwitchBoard (U1.1), SwitchConnectors (T1.2)
P1_TXRXB_N: EthernetSwitchBoard (U1.5), SwitchConnectors (T1.6)
P1_TXRXB_P: EthernetSwitchBoard (U1.4), SwitchConnectors (T1.5)
P1_TXRXC_N: EthernetSwitchBoard (U1.7), SwitchConnectors (T1.9)
P1_TXRXC_P: EthernetSwitchBoard (U1.6), SwitchConnectors (T1.8)
P1_TXRXD_N: EthernetSwitchBoard (U1.9), SwitchConnectors (T1.12)
P1_TXRXD_P: EthernetSwitchBoard (U1.8), SwitchConnectors (T1.11)
P2_TXRXA_N: EthernetSwitchBoard (U1.13), SwitchConnectors (T2.3)
P2_TXRXA_P: EthernetSwitchBoard (U1.12), SwitchConnectors (T2.2)
P2_TXRXB_N: EthernetSwitchBoard (U1.16), SwitchConnectors (T2.6)
P2_TXRXB_P: EthernetSwitchBoard (U1.15), SwitchConnectors (T2.5)
P2_TXRXC_N: EthernetSwitchBoard (U1.18), SwitchConnectors (T2.9)
P2_TXRXC_P: EthernetSwitchBoard (U1.17), SwitchConnectors (T2.8)
P2_TXRXD_N: EthernetSwitchBoard (U1.21), SwitchConnectors (T2.12)
P2_TXRXD_P: EthernetSwitchBoard (U1.20), SwitchConnectors (T2.11)
P3_TXRXA_N: EthernetSwitchBoard (U1.25), SwitchConnectors (T3.3)
P3_TXRXA_P: EthernetSwitchBoard (U1.24), SwitchConnectors (T3.2)
P3_TXRXB_N: EthernetSwitchBoard (U1.27), SwitchConnectors (T3.6)
P3_TXRXB_P: EthernetSwitchBoard (U1.26), SwitchConnectors (T3.5)
P3_TXRXC_N: EthernetSwitchBoard (U1.29), SwitchConnectors (T3.9)
P3_TXRXC_P: EthernetSwitchBoard (U1.28), SwitchConnectors (T3.8)
P3_TXRXD_N: EthernetSwitchBoard (U1.32), SwitchConnectors (T3.12)
P3_TXRXD_P: EthernetSwitchBoard (U1.31), SwitchConnectors (T3.11)
P4_TXRXA_N: EthernetSwitchBoard (U1.35), SwitchConnectors (T4.3)
P4_TXRXA_P: EthernetSwitchBoard (U1.34), SwitchConnectors (T4.2)
P4_TXRXB_N: EthernetSwitchBoard (U1.38), SwitchConnectors (T4.6)
P4_TXRXB_P: EthernetSwitchBoard (U1.37), SwitchConnectors (T4.5)
P4_TXRXC_N: EthernetSwitchBoard (U1.40), SwitchConnectors (T4.9)
P4_TXRXC_P: EthernetSwitchBoard (U1.39), SwitchConnectors (T4.8)
P4_TXRXD_N: EthernetSwitchBoard (U1.43), SwitchConnectors (T4.12)
P4_TXRXD_P: EthernetSwitchBoard (U1.42), SwitchConnectors (T4.11)
P5_TXRXA_N: EthernetSwitchBoard (U1.113), SwitchConnectors (T5.3)
P5_TXRXA_P: EthernetSwitchBoard (U1.112), SwitchConnectors (T5.2)
P5_TXRXB_N: EthernetSwitchBoard (U1.116), SwitchConnectors (T5.6)
P5_TXRXB_P: EthernetSwitchBoard (U1.115), SwitchConnectors (T5.5)
P5_TXRXC_N: EthernetSwitchBoard (U1.118), SwitchConnectors (T5.9)
P5_TXRXC_P: EthernetSwitchBoard (U1.117), SwitchConnectors (T5.8)
P5_TXRXD_N: EthernetSwitchBoard (U1.121), SwitchConnectors (T5.12)
P5_TXRXD_P: EthernetSwitchBoard (U1.120), SwitchConnectors (T5.11)